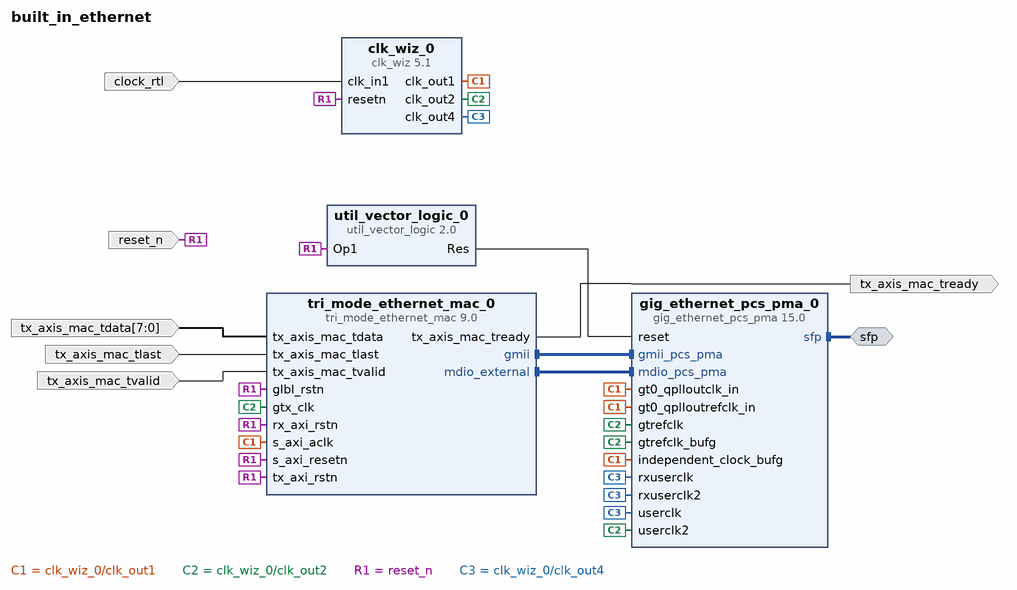
[diagram p0: block diagram of the top level]
# Vivado block design built_in_ethernet, Vivado 2015.2
create_bd_design built_in_ethernet

create_bd_intf_port -mode Master -vlnv xilinx.com:interface:sfp_rtl:1.0 sfp
create_bd_port -dir I -type clk clock_rtl
set_property -dict {CONFIG.FREQ_HZ 100000000 CONFIG.PHASE 0.000} [get_bd_ports clock_rtl]
create_bd_port -dir I -type rst reset_n
set_property -dict {CONFIG.POLARITY ACTIVE_LOW} [get_bd_ports reset_n]
create_bd_port -dir I -from 7 -to 0 tx_axis_mac_tdata
create_bd_port -dir I tx_axis_mac_tlast
create_bd_port -dir O tx_axis_mac_tready
create_bd_port -dir I tx_axis_mac_tvalid

create_bd_cell -type ip -vlnv xilinx.com:ip:tri_mode_ethernet_mac:9.0 tri_mode_ethernet_mac_0
set_property -dict {CONFIG.Physical_Interface GMII CONFIG.MAC_Speed Tri_speed} [get_bd_cells tri_mode_ethernet_mac_0]
create_bd_cell -type ip -vlnv xilinx.com:ip:clk_wiz:5.1 clk_wiz_0
set_property -dict [list \
  CONFIG.CLKOUT2_USED true \
  CONFIG.CLKOUT3_USED true \
  CONFIG.CLKOUT4_USED true \
  CONFIG.NUM_OUT_CLKS 4 \
  CONFIG.CLKOUT1_REQUESTED_OUT_FREQ 100.000 \
  CONFIG.CLKOUT2_REQUESTED_OUT_FREQ 125.000 \
  CONFIG.CLKOUT3_REQUESTED_OUT_FREQ 125.000 \
  CONFIG.CLKOUT3_REQUESTED_PHASE 90.000 \
  CONFIG.CLKOUT4_REQUESTED_OUT_FREQ 62.500 \
  CONFIG.RESET_PORT resetn \
  CONFIG.MMCM_DIVCLK_DIVIDE 1 \
  CONFIG.MMCM_CLKOUT0_DIVIDE_F 10.000 \
  CONFIG.MMCM_CLKOUT1_DIVIDE 8 \
  CONFIG.MMCM_CLKOUT2_DIVIDE 8 \
  CONFIG.MMCM_CLKOUT2_PHASE 90.000 \
  CONFIG.MMCM_CLKOUT3_DIVIDE 16 \
  CONFIG.RESET_TYPE ACTIVE_LOW \
  CONFIG.USE_BOARD_FLOW true \
  CONFIG.RESET_BOARD_INTERFACE reset \
  CONFIG.CLKOUT1_JITTER 130.958 \
  CONFIG.CLKOUT2_JITTER 125.247 \
  CONFIG.CLKOUT2_PHASE_ERROR 98.575 \
  CONFIG.CLKOUT3_JITTER 125.247 \
  CONFIG.CLKOUT3_PHASE_ERROR 98.575 \
  CONFIG.CLKOUT4_JITTER 144.481 \
  CONFIG.CLKOUT4_PHASE_ERROR 98.575 \
] [get_bd_cells clk_wiz_0]
create_bd_cell -type ip -vlnv xilinx.com:ip:gig_ethernet_pcs_pma:15.0 gig_ethernet_pcs_pma_0
set_property -dict {CONFIG.USE_BOARD_FLOW true CONFIG.ETHERNET_BOARD_INTERFACE sfp} [get_bd_cells gig_ethernet_pcs_pma_0]
create_bd_cell -type ip -vlnv xilinx.com:ip:util_vector_logic:2.0 util_vector_logic_0
set_property -dict {CONFIG.C_OPERATION not} [get_bd_cells util_vector_logic_0]

# ---- connections ----

connect_bd_intf_net [get_bd_intf_pins tri_mode_ethernet_mac_0/gmii] [get_bd_intf_pins gig_ethernet_pcs_pma_0/gmii_pcs_pma]
connect_bd_intf_net [get_bd_intf_pins tri_mode_ethernet_mac_0/mdio_external] [get_bd_intf_pins gig_ethernet_pcs_pma_0/mdio_pcs_pma]
connect_bd_intf_net [get_bd_intf_ports sfp] [get_bd_intf_pins gig_ethernet_pcs_pma_0/sfp]
connect_bd_net [get_bd_ports clock_rtl] [get_bd_pins clk_wiz_0/clk_in1]
connect_bd_net [get_bd_pins clk_wiz_0/clk_out1] \
  [get_bd_pins tri_mode_ethernet_mac_0/s_axi_aclk] [get_bd_pins gig_ethernet_pcs_pma_0/gt0_qplloutclk_in] \
  [get_bd_pins gig_ethernet_pcs_pma_0/gt0_qplloutrefclk_in] [get_bd_pins gig_ethernet_pcs_pma_0/independent_clock_bufg]
connect_bd_net [get_bd_pins clk_wiz_0/clk_out2] \
  [get_bd_pins tri_mode_ethernet_mac_0/gtx_clk] [get_bd_pins gig_ethernet_pcs_pma_0/gtrefclk_bufg] \
  [get_bd_pins gig_ethernet_pcs_pma_0/gtrefclk] [get_bd_pins gig_ethernet_pcs_pma_0/userclk2]
connect_bd_net -net reset_1 [get_bd_ports reset_n] \
  [get_bd_pins clk_wiz_0/resetn] [get_bd_pins tri_mode_ethernet_mac_0/rx_axi_rstn] \
  [get_bd_pins tri_mode_ethernet_mac_0/tx_axi_rstn] [get_bd_pins tri_mode_ethernet_mac_0/glbl_rstn] \
  [get_bd_pins tri_mode_ethernet_mac_0/s_axi_resetn] [get_bd_pins util_vector_logic_0/Op1]
connect_bd_net [get_bd_pins clk_wiz_0/clk_out4] \
  [get_bd_pins gig_ethernet_pcs_pma_0/userclk] [get_bd_pins gig_ethernet_pcs_pma_0/rxuserclk] \
  [get_bd_pins gig_ethernet_pcs_pma_0/rxuserclk2]
connect_bd_net [get_bd_pins util_vector_logic_0/Res] [get_bd_pins gig_ethernet_pcs_pma_0/reset]
connect_bd_net [get_bd_ports tx_axis_mac_tdata] [get_bd_pins tri_mode_ethernet_mac_0/tx_axis_mac_tdata]
connect_bd_net [get_bd_ports tx_axis_mac_tlast] [get_bd_pins tri_mode_ethernet_mac_0/tx_axis_mac_tlast]
connect_bd_net [get_bd_pins tri_mode_ethernet_mac_0/tx_axis_mac_tready] [get_bd_ports tx_axis_mac_tready]
connect_bd_net [get_bd_ports tx_axis_mac_tvalid] [get_bd_pins tri_mode_ethernet_mac_0/tx_axis_mac_tvalid]

validate_bd_design
save_bd_design
